# EAGLE schematic vm8_board (EAGLE 9.3.0)
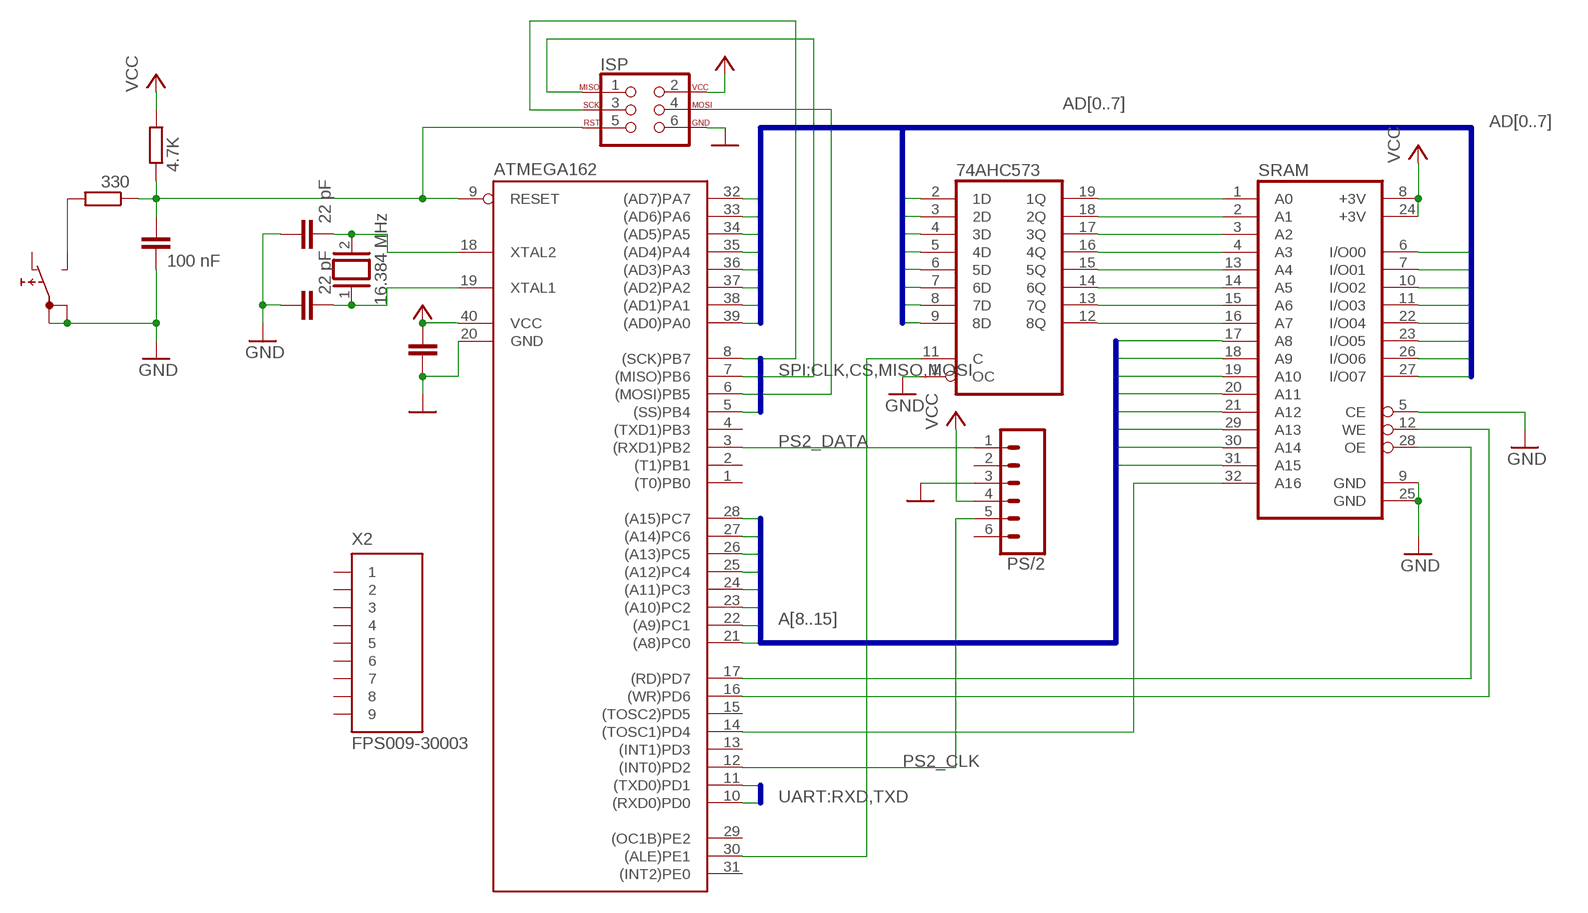
[diagram p0: schematic, sheet 1]

## Parts
74AHC573  74HCT573N  [DIL20]
ATMEGA162  MEGA161P  [DIL40]
C1  22 pF  C-EU025-025X050  [C025-025X050]
C2  22 pF  C-EU025-025X050  [C025-025X050]
C3  C-EU025-025X050  [C025-025X050]
C4  100 nF  C-EU025-025X050  [C025-025X050]
ISP  AVR_SPI_PROG_3X2NS  [2X3-NS]
PS/2  CONN_06FEMALE_LOCK  [1X06_FEMALE_LOCK.010]
Q1  16.384 MHz  XTAL/S  [QS]
R1  4.7K  R-EU_0204/2V  [0204V]
R2  330  R-EU_0204/2V  [0204V]
S1  5501  [5501]
SRAM  CY7C1019CV33-15VC  [SOJ32-400]
X2  FPS009-30003  [FPS009-3003]

## Nets
A8: ATMEGA162.21((A8)PC0) SRAM.17(A8)
A9: ATMEGA162.22((A9)PC1) SRAM.18(A9)
A10: ATMEGA162.23((A10)PC2) SRAM.19(A10)
A11: ATMEGA162.24((A11)PC3) SRAM.20(A11)
A12: ATMEGA162.25((A12)PC4) SRAM.21(A12)
A13: ATMEGA162.26((A13)PC5) SRAM.29(A13)
A14: ATMEGA162.27((A14)PC6) SRAM.30(A14)
A15: ATMEGA162.28((A15)PC7) SRAM.31(A15)
AD0: 74AHC573.2(1D) ATMEGA162.39((AD0)PA0) SRAM.6(I/O00)
AD1: 74AHC573.3(2D) ATMEGA162.38((AD1)PA1) SRAM.7(I/O01)
AD2: 74AHC573.4(3D) ATMEGA162.37((AD2)PA2) SRAM.10(I/O02)
AD3: 74AHC573.5(4D) ATMEGA162.36((AD3)PA3) SRAM.11(I/O03)
AD4: 74AHC573.6(5D) ATMEGA162.35((AD4)PA4) SRAM.22(I/O04)
AD5: 74AHC573.7(6D) ATMEGA162.34((AD5)PA5) SRAM.23(I/O05)
AD6: 74AHC573.8(7D) ATMEGA162.33((AD6)PA6) SRAM.26(I/O06)
AD7: 74AHC573.9(8D) ATMEGA162.32((AD7)PA7) SRAM.27(I/O07)
CLK: ATMEGA162.8((SCK)PB7) ISP.3
CS: ATMEGA162.5((SS)PB4)
GND: 74AHC573.1(OC) ATMEGA162.20(GND) C1.1 C2.1 C3.2 C4.2 ISP.6 PS/2.3 S1.1A S1.1B SRAM.5(CE) SRAM.9(GND) SRAM.25(GND)
MISO: ATMEGA162.7((MISO)PB6) ISP.1
MOSI: ATMEGA162.6((MOSI)PB5) ISP.4
N$1: 74AHC573.19(1Q) SRAM.1(A0)
N$2: 74AHC573.18(2Q) SRAM.2(A1)
N$3: 74AHC573.17(3Q) SRAM.3(A2)
N$4: 74AHC573.16(4Q) SRAM.4(A3)
N$5: 74AHC573.15(5Q) SRAM.13(A4)
N$6: 74AHC573.14(6Q) SRAM.14(A5)
N$7: 74AHC573.13(7Q) SRAM.15(A6)
N$8: 74AHC573.12(8Q) SRAM.16(A7)
N$9: ATMEGA162.16((WR)PD6) SRAM.12(WE)
N$10: ATMEGA162.17((RD)PD7) SRAM.28(OE)
N$11: 74AHC573.11(C) ATMEGA162.30((ALE)PE1)
N$12: ATMEGA162.14((TOSC1)PD4) SRAM.32(A16)
N$13: ATMEGA162.9(RESET) C4.1 ISP.5 R1.1 R2.1
N$14: R2.2 S1.NO
N$16: ATMEGA162.18(XTAL2) C1.2 Q1.2
N$17: ATMEGA162.19(XTAL1) C2.2 Q1.1
PS2_CLK: ATMEGA162.12((INT0)PD2) PS/2.5
PS2_DATA: ATMEGA162.3((RXD1)PB2) PS/2.1
RXD: ATMEGA162.10((RXD0)PD0)
TXD: ATMEGA162.11((TXD0)PD1)
VCC: ATMEGA162.40(VCC) C3.1 ISP.2 PS/2.4 R1.2 SRAM.8(+3V) SRAM.24(+3V)
Unconnected: ATMEGA162.1((T0)PB0) ATMEGA162.2((T1)PB1) ATMEGA162.4((TXD1)PB3) ATMEGA162.13((INT1)PD3) ATMEGA162.15((TOSC2)PD5) ATMEGA162.29((OC1B)PE2) ATMEGA162.31((INT2)PE0) PS/2.2 PS/2.6 S1.NC X2.1 X2.2 X2.3 X2.4 X2.5 X2.6 X2.7 X2.8 X2.9

## Buses
AD[0..7]
A[8..15]
SPI:CLK,CS,MISO,MOSI
UART:RXD,TXD

## Power pins joined to a net without a drawn wire
GND: 74AHC573.10(GND)
VCC: 74AHC573.20(VCC)

## Library data of the parts
74AHC573 = 74xx-eu:74*573: 8-bit D latch BUS DRIVER
ATMEGA162 = atmel:MEGA161*P: MICROCONTROLLER 16 Kbytes FLASH 512 bytes EEPROM 1 Kbytes SRAM dual UART hardware multiplier Source: avr.lbr; MPN: ATMEGA16-16PU; OC_FARNELL: 9171142; OC_NEWARK: 98M0167
C1-C4 = rcl:C-EU: CAPACITOR, European symbol; SPICEPREFIX: C
ISP = SparkFun-Connectors:AVR_SPI_PROG_3X2: AVR ISP 6 Pin This is the reduced ISP connector for AVR programming. Common on Arduino. This footprint will take up less PCB space and can be used with a 10-pin to 6-pin adapter such as SKU: BOB-08508 **Special note about "TEST_POINT" package. The stop mask is on the top side, so if you want your programming test points to be on the bottom of your board, make sure to place this package on the bottom side of the board. This also ensure that the orientation to program from the bottom side will be correct. SparkFun Products: SparkFun ISP Pogo Adapter <https://www.sparkfun.com/products/11591> - NS Tiny AVR Programmer <https://www.sparkfun.com/products/11801> -PTH
PS/2 = SparkFun-Connectors:CONN_06: Multi connection point. Often used as Generic Header-pin footprint for 0.1 inch spaced/style header connections On any of the 0.1 inch spaced packages, you can populate with these: Break Away Headers - Straight <https://www.sparkfun.com/products/116> (PRT-00116) Break Away Male Headers - Right Angle <https://www.sparkfun.com/products/553> (PRT-00553) Female Headers <https://www.sparkfun.com/products/115> (PRT-00115) Break Away Headers - Machine Pin <https://www.sparkfun.com/products/117> (PRT-00117) Break Away Female Headers - Swiss Machine Pin <https://www.sparkfun.com/products/743> (PRT-00743) Arduino Stackable Header - 6 Pin <https://www.sparkfun.com/products/9280> (PRT-09280) For SCREWTERMINALS and SPRING TERMINALS visit here: Screw Terimnals on SparkFun.com <https://www.sparkfun.com/search/results?term=Screw+Terminals> (5mm/3.5mm/2.54mm spacing) This device is also useful as a general connection point to wire up your design to another part of your project. Our various solder wires solder well into these plated through hole pads. Hook-Up Wire - Assortment (Stranded, 22 AWG) <https://www.sparkfun.com/products/11375> (PRT-11375) Hook-Up Wire - Assortment (Solid Core, 22 AWG) <https://www.sparkfun.com/products/11367> (PRT-11367) View the entire wire category on our website here <https://www.sparkfun.com/categories/141>
Q1 = special:XTAL/S: CRYSTAL
R1 R2 = rcl:R-EU_: RESISTOR, European symbol; SPICEPREFIX: R
S1 = switch:55?: PUSHBUTTON SERIES 5500 SWITCHES Source: www.e-switch.com .. 5500.pdf
SRAM = memory-sram:CY7C1019CV33: 128K x 8 Static RAM 10ns Source: Cypress CYP05780611.pdf
X2 = con-yamaichi:FPS009-30*: SD Card and MMC Reader (Manual Insertion) Source: http://www.yamaichi.de/pdf/c_fps009_3000.pdf; MPN: FPS009-3003-BL; OC_FARNELL: 1143953; OC_NEWARK: 91K9876